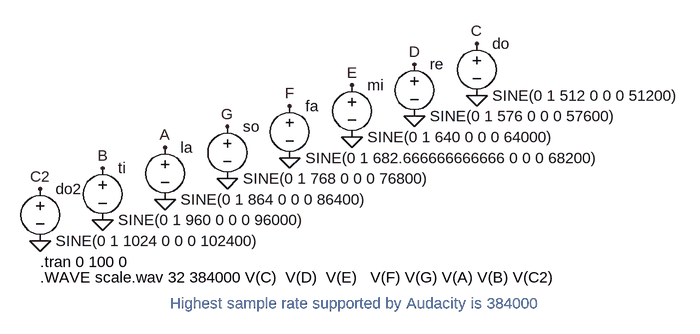
[diagram p0: schematic scale.asc]
scale.asc, the LTspice schematic file:
Version 4
SHEET 1 880 752
FLAG 96 416 0
FLAG 96 336 C
FLAG 0 368 D
FLAG -96 480 0
FLAG -96 400 E
FLAG -192 432 F
FLAG -288 544 0
FLAG -288 464 G
FLAG -384 496 A
FLAG -480 608 0
FLAG -480 528 B
FLAG -576 560 C2
FLAG 0 448 0
FLAG -192 512 0
FLAG -576 640 0
FLAG -384 576 0
SYMBOL voltage 96 320 R0
WINDOW 123 0 0 Left 0
WINDOW 39 0 0 Left 0
SYMATTR InstName do
SYMATTR Value SINE(0 1 512 0 0 0 51200)
SYMBOL voltage 0 352 R0
WINDOW 123 0 0 Left 0
WINDOW 39 0 0 Left 0
SYMATTR InstName re
SYMATTR Value SINE(0 1 576 0 0 0 57600)
SYMBOL voltage -96 384 R0
WINDOW 123 0 0 Left 0
WINDOW 39 0 0 Left 0
SYMATTR InstName mi
SYMATTR Value SINE(0 1 640 0 0 0 64000)
SYMBOL voltage -192 416 R0
WINDOW 123 0 0 Left 0
WINDOW 39 0 0 Left 0
SYMATTR InstName fa
SYMATTR Value SINE(0 1 682.666666666666 0 0 0 68200)
SYMBOL voltage -288 448 R0
WINDOW 123 0 0 Left 0
WINDOW 39 0 0 Left 0
SYMATTR InstName so
SYMATTR Value SINE(0 1 768 0 0 0 76800)
SYMBOL voltage -384 480 R0
WINDOW 123 0 0 Left 0
WINDOW 39 0 0 Left 0
SYMATTR InstName la
SYMATTR Value SINE(0 1 864 0 0 0 86400)
SYMBOL voltage -480 512 R0
WINDOW 123 0 0 Left 0
WINDOW 39 0 0 Left 0
SYMATTR InstName ti
SYMATTR Value SINE(0 1 960 0 0 0 96000)
SYMBOL voltage -576 544 R0
WINDOW 123 0 0 Left 0
WINDOW 39 0 0 Left 0
SYMATTR InstName do2
SYMATTR Value SINE(0 1 1024 0 0 0 102400)
TEXT -576 672 Left 2 !.tran 0 100 0
TEXT -576 696 Left 2 !.WAVE scale.wav 32 384000 V(C)  V(D)  V(E)   V(F) V(G) V(A) V(B) V(C2)
TEXT -376 736 Left 2 ;Highest sample rate supported by Audacity is 384000

The netlist it stands for:
* scale.asc
V§do C 0 SINE(0 1 512 0 0 0 51200)
V§re D 0 SINE(0 1 576 0 0 0 57600)
V§mi E 0 SINE(0 1 640 0 0 0 64000)
V§fa F 0 SINE(0 1 682.666666666666 0 0 0 68200)
V§so G 0 SINE(0 1 768 0 0 0 76800)
V§la A 0 SINE(0 1 864 0 0 0 86400)
V§ti B 0 SINE(0 1 960 0 0 0 96000)
V§do2 C2 0 SINE(0 1 1024 0 0 0 102400)
.tran 0 100 0
.WAVE scale.wav 32 384000 V(C)  V(D)  V(E)   V(F) V(G) V(A) V(B) V(C2)
* Highest sample rate supported by Audacity is 384000
.backanno
.end